# EAGLE design base_board7 (EAGLE 9.3.0)
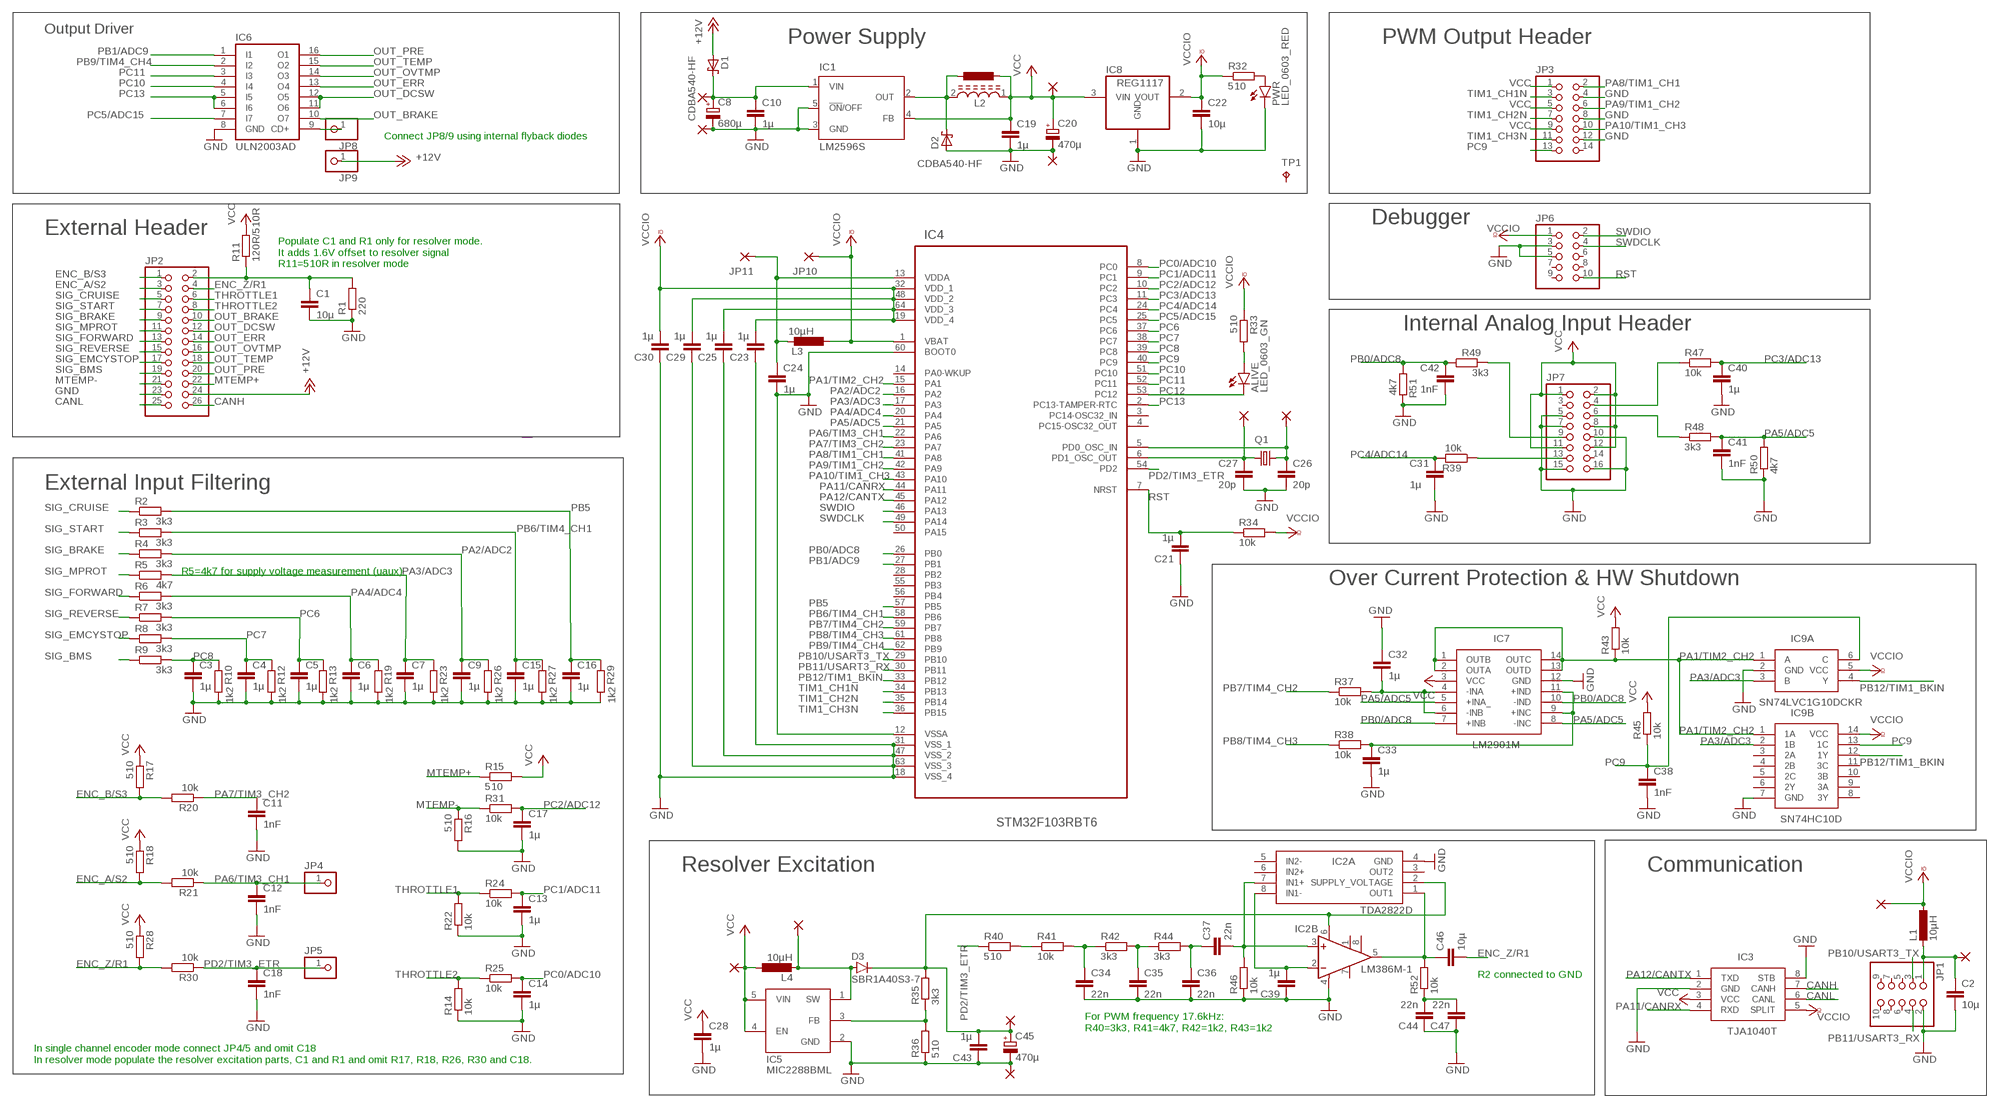
[diagram p0: schematic, sheet 1]

## Parts
ALIVE  LED_0603_GN  LEDSML0805  [SML0805]
C1  10µ  C-EUC0805K  [C0805K]
C2  10µ  C-EUC0805K  [C0805K]
C3  1µ  C-EUC0603K  [C0603K]
C4  1µ  C-EUC0603K  [C0603K]
C5  1µ  C-EUC0603K  [C0603K]
C6  1µ  C-EUC0603K  [C0603K]
C7  1µ  C-EUC0603K  [C0603K]
C8  680µ  CPOL-EU153CLV-1014  [153CLV-1014]
C9  1µ  C-EUC0603K  [C0603K]
C10  1µ  C-EUC0603K  [C0603K]
C11  1nF  C-EUC0603K  [C0603K]
C12  1nF  C-EUC0603K  [C0603K]
C13  1µ  C-EUC0603K  [C0603K]
C14  1µ  C-EUC0603K  [C0603K]
C15  1µ  C-EUC0603K  [C0603K]
C16  1µ  C-EUC0603K  [C0603K]
C17  1µ  C-EUC0603K  [C0603K]
C18  1nF  C-EUC0603K  [C0603K]
C19  1µ  C-EUC0603K  [C0603K]
C20  470µ  CPOL-EU153CLV-0605  [153CLV-0605]
C21  1µ  C-EUC0603K  [C0603K]
C22  10µ  C-EUC0805K  [C0805K]
C23  1µ  C-EUC0603K  [C0603K]
C24  1µ  C-EUC0603K  [C0603K]
C25  1µ  C-EUC0603K  [C0603K]
C26  20p  C-EUC0603K  [C0603K]
C27  20p  C-EUC0603K  [C0603K]
C28  1µ  C-EUC0603K  [C0603K]
C29  1µ  C-EUC0603K  [C0603K]
C30  1µ  C-EUC0603K  [C0603K]
C31  1µ  C-EUC0603K  [C0603K]
C32  1µ  C-EUC0603K  [C0603K]
C33  1µ  C-EUC0603K  [C0603K]
C34  22n  C-EUC0603K  [C0603K]
C35  22n  C-EUC0603K  [C0603K]
C36  22n  C-EUC0603K  [C0603K]
C37  22n  C-EUC0603K  [C0603K]
C38  1nF  C-EUC0603K  [C0603K]
C39  1µ  C-EUC0603K  [C0603K]
C40  1µ  C-EUC0603K  [C0603K]
C41  1nF  C-EUC0603K  [C0603K]
C42  1nF  C-EUC0603K  [C0603K]
C43  1µ  C-EUC0603K  [C0603K]
C44  22n  C-EUC0603K  [C0603K]
C45  470µ  CPOL-EU153CLV-0605  [153CLV-0605]
C46  10µ  C-EUC0805K  [C0805K]
C47  22n  C-EUC0603K  [C0603K]
D1  CDBA540-HF  SCHOTTKY-DIODESMD  [SMB]
D2  CDBA540-HF  SCHOTTKY-DIODESMD  [SMB]
D3  SBR1A40S3-7  D-SOD123  [SOD123]
IC1  LM2596S  [TO263-5]
IC2A  TDA2822D  [SOIC127P600X175-8N]
IC2B  LM386M-1  [SO08]
IC3  TJA1040T  [SOIC127P600X175-8N]
IC4  STM32F103RBT6  [QFP50P1200X1200X160-64N]
IC5  MIC2288BML  [SOT23-5L]
IC6  ULN2003AD  [SO16]
IC7  LM2901M  [SOP127P600X180-14N]
IC8  REG1117  [SOT223]
IC9A  SN74LVC1G10DCKR  [SOT65P210X110-6N]
IC9B  SN74HC10D  [SOIC127P600X175-14N]
JP1  PINHD-2X5/90  [2X05/90]
JP2  PINHD-2X13  [2X13]
JP3  PINHD-2X7  [2X07]
JP4  PINHD-1X1  [1X01]
JP5  PINHD-1X1  [1X01]
JP6  PINHD-2X5  [2X05]
JP7  PINHD-2X8  [2X08]
JP8  PINHD-1X1  [1X01]
JP9  PINHD-1X1  [1X01]
JP10  1,6/0,9  [1,6/0,9]
JP11  1,6/0,9  [1,6/0,9]
JP12  1,6/0,8  [1,6/0,8]
JP13  1,6/0,8  [1,6/0,8]
JP14  1,6/0,8  [1,6/0,8]
JP15  1,6/0,8  [1,6/0,8]
JP16  1,6/0,8  [1,6/0,8]
JP17  1,6/0,8  [1,6/0,8]
L1  10µH  L-EUL3225M  [L3225M]
L2  SRR1260-471K  [INDP125125X600N]
L3  10µH  L-EUL3225M  [L3225M]
L4  10µH  L-EUL3225M  [L3225M]
L5  L-EUTJ3-U1  [TJ3-U1]
PAD1  1,6/0,9  [1,6/0,9]
PAD2  1,6/0,9  [1,6/0,9]
PAD3  1,6/0,8  [1,6/0,8]
PAD4  1,6/0,8  [1,6/0,8]
PAD5  1,6/0,8  [1,6/0,8]
PAD6  1,6/0,8  [1,6/0,8]
PWR  LED_0603_RED  LEDSML0805  [SML0805]
Q1  CSM-7X-DU  [CSM-7X-DU]
R1  220  R-EU_R0603  [R0603]
R2  3k3  R-EU_R0603  [R0603]
R3  3k3  R-EU_R0603  [R0603]
R4  3k3  R-EU_R0603  [R0603]
R5  4k7  R-EU_R0603  [R0603]
R6  3k3  R-EU_R0603  [R0603]
R7  3k3  R-EU_R0603  [R0603]
R8  3k3  R-EU_R0603  [R0603]
R9  3k3  R-EU_R0603  [R0603]
R10  1k2  R-EU_R0603  [R0603]
R11  120R/510R  R-EU_R0603  [R0603]
R12  1k2  R-EU_R0603  [R0603]
R13  1k2  R-EU_R0603  [R0603]
R14  10k  R-EU_R0603  [R0603]
R15  510  R-EU_R0603  [R0603]
R16  510  R-EU_R0603  [R0603]
R17  510  R-EU_R0603  [R0603]
R18  510  R-EU_R0603  [R0603]
R19  1k2  R-EU_R0603  [R0603]
R20  10k  R-EU_R0603  [R0603]
R21  10k  R-EU_R0603  [R0603]
R22  10k  R-EU_R0603  [R0603]
R23  1k2  R-EU_R0603  [R0603]
R24  10k  R-EU_R0603  [R0603]
R25  10k  R-EU_R0603  [R0603]
R26  1k2  R-EU_R0603  [R0603]
R27  1k2  R-EU_R0603  [R0603]
R28  510  R-EU_R0603  [R0603]
R29  1k2  R-EU_R0603  [R0603]
R30  10k  R-EU_R0603  [R0603]
R31  10k  R-EU_R0603  [R0603]
R32  510  R-EU_R0603  [R0603]
R33  510  R-EU_R0603  [R0603]
R34  10k  R-EU_R0603  [R0603]
R35  3k3  R-EU_R0603  [R0603]
R36  510  R-EU_R0603  [R0603]
R37  10k  R-EU_R0603  [R0603]
R38  10k  R-EU_R0603  [R0603]
R39  10k  R-EU_R0603  [R0603]
R40  510  R-EU_R0603  [R0603]
R41  10k  R-EU_R0603  [R0603]
R42  3k3  R-EU_R0603  [R0603]
R43  10k  R-EU_R0603  [R0603]
R44  3k3  R-EU_R0603  [R0603]
R45  10k  R-EU_R0603  [R0603]
R46  10k  R-EU_R0603  [R0603]
R47  10k  R-EU_R0603  [R0603]
R48  3k3  R-EU_R0603  [R0603]
R49  3k3  R-EU_R0603  [R0603]
R50  4k7  R-EU_R0603  [R0603]
R51  4k7  R-EU_R0603  [R0603]
R52  10k  R-EU_R0603  [R0603]
TP1  TPB1,27  [B1,27]

## Nets
+12V: D1.A JP2.24 JP9.1
CANH: IC3.7(CANH) JP2.26
CANL: IC3.6(CANL) JP2.25
ENC_A/S2: JP2.3 R18.2 R21.2
ENC_B/S3: JP2.1 R17.2 R20.2
ENC_Z/R1: C46.2 JP2.4 R28.2 R30.2
GND: C1.2 C2.2 C3.2 C4.2 C5.2 C6.2 C7.2 C8.- C9.2 C10.2 C11.2 C12.2 C13.2 C14.2 C15.2 C16.2 C17.2 C18.2 C19.2 C20.- C21.1 C22.2 C23.1 C24.2 C25.1 C26.2 C27.2 C28.2 C29.1 C30.1 C31.2 C32.1 C33.2 C34.2 C35.2 C36.2 C38.2 C39.1 C40.2 C41.2 C42.2 C43.1 C44.1 C45.- C47.1 D2.A IC1.3(GND) IC1.5(!ON!/OFF) IC2A.4(GND) IC2B.4(GND) IC3.2(GND) IC3.8(STB) IC4.12(VSSA) IC4.18(VSS_4) IC4.31(VSS_1) IC4.47(VSS_2) IC4.60(BOOT0) IC4.63(VSS_3) IC5.2(GND) IC6.8(GND) IC7.12(GND) IC8.1(GND) IC9A.2(GND) IC9B.7(GND) JP1.2 JP2.23 JP3.4 JP3.8 JP3.12 JP6.3 JP6.5 JP7.5 JP7.7 JP7.10 JP7.15 JP7.16 PAD1.1(P) PAD3.1(P) PAD6.1(P) PWR.C R1.1 R10.2 R12.2 R13.2 R14.1 R16.2 R19.2 R22.1 R23.2 R26.2 R27.2 R29.2 R36.1 R46.1 R50.1 R51.2
MTEMP+: JP2.22 R15.1
MTEMP-: JP2.21 R16.1 R31.1
N$1: C1.1 JP2.2 R1.2 R11.1
N$2: ALIVE.A R33.2
N$3: D2.C IC1.2(OUT) L2.2 L5.1
N$4: C8.+ C10.1 D1.C IC1.1(VIN) PAD2.1(P)
N$5: PWR.A R32.2
N$7: C27.1 IC4.6(PD1_OSC_OUT) JP17.1(P) Q1.1
N$8: C24.1 IC4.13(VDDA) JP11.1(P) L3.1
N$9: IC6.9(CD+) JP8.1
N$10: JP7.9 R49.2
N$11: JP7.13 R39.1
N$12: JP7.4 R47.1
N$13: JP7.6 R48.1
N$14: C32.2 IC7.4(-INA) IC7.6(-INB) R37.2
N$15: C33.1 IC7.9(+INC) IC7.11(+IND) R38.2
N$16: D3.2(A) IC5.1(SW) JP13.1(P) L4.2
N$17: IC5.3(FB) R35.1 R36.2
N$18: C43.2 C45.+ D3.1(C) IC2A.2(SUPPLY_VOLTAGE) IC2B.6(VS) PAD5.1(P) R35.2
N$19: R40.2 R41.1
N$20: C34.1 R41.2 R42.1
N$21: C35.1 R42.2 R44.1
N$22: C36.1 C37.1 R44.2
N$23: C39.2 IC2A.8(IN1-) IC2B.2(-IN)
N$24: C37.2 IC2A.7(IN1+) IC2B.3(+IN) R46.2
N$25: C44.2 C47.2 R52.1
N$26: C46.1 IC2A.1(OUT1) IC2B.5(OUT) R52.2
N$27: C2.1 JP1.1 JP15.1(P) L1.2
N$28: C26.1 IC4.5(PD0_OSC_IN) JP16.1(P) Q1.2
OUT_BRAKE: IC6.10(O7) JP2.10
OUT_DCSW: IC6.11(O6) IC6.12(O5) JP2.12
OUT_ERR: IC6.13(O4) JP2.14
OUT_OVTMP: IC6.14(O3) JP2.16
OUT_PRE: IC6.16(O1) JP2.20
OUT_TEMP: IC6.15(O2) JP2.18
PA1/TIM2_CH2: IC4.15(PA1) IC7.1(OUTB) IC7.2(OUTA) IC7.13(OUTD) IC7.14(OUTC) IC9A.1(A) IC9B.1(1A) R43.1
PA2/ADC2: C9.1 IC4.16(PA2) R4.2 R26.1
PA3/ADC3: C7.1 IC4.17(PA3) IC9A.3(B) IC9B.2(1B) R5.2 R23.1
PA4/ADC4: C6.1 IC4.20(PA4) R6.2 R19.1
PA5/ADC5: C41.1 IC4.21(PA5) IC7.5(+INA_) IC7.8(-INC) R48.2 R50.2
PA6/TIM3_CH1: C12.1 IC4.22(PA6) JP4.1 R21.1
PA7/TIM3_CH2: C11.1 IC4.23(PA7) R20.1
PA8/TIM1_CH1: IC4.41(PA8) JP3.2
PA9/TIM1_CH2: IC4.42(PA9) JP3.6
PA10/TIM1_CH3: IC4.43(PA10) JP3.10
PA11/CANRX: IC3.4(RXD) IC4.44(PA11)
PA12/CANTX: IC3.1(TXD) IC4.45(PA12)
PB0/ADC8: C42.1 IC4.26(PB0) IC7.7(+INB) IC7.10(-IND) R49.1 R51.1
PB1/ADC9: IC4.27(PB1) IC6.1(I1)
PB5: C16.1 IC4.57(PB5) R2.2 R29.1
PB6/TIM4_CH1: C15.1 IC4.58(PB6) R3.2 R27.1
PB7/TIM4_CH2: IC4.59(PB7) R37.1
PB8/TIM4_CH3: IC4.61(PB8) R38.1
PB9/TIM4_CH4: IC4.62(PB9) IC6.2(I2)
PB10/USART3_TX: IC4.29(PB10) JP1.3
PB11/USART3_RX: IC4.30(PB11) JP1.4
PB12/TIM1_BKIN: IC4.33(PB12) IC9A.4(Y) IC9B.12(1Y)
PC0/ADC10: C14.1 IC4.8(PC0) R25.2
PC1/ADC11: C13.1 IC4.9(PC1) R24.2
PC2/ADC12: C17.1 IC4.10(PC2) R31.2
PC3/ADC13: C40.1 IC4.11(PC3) R47.2
PC4/ADC14: C31.1 IC4.24(PC4) R39.2
PC5/ADC15: IC4.25(PC5) IC6.7(I7)
PC6: C5.1 IC4.37(PC6) R7.2 R13.1
PC7: C4.1 IC4.38(PC7) R8.2 R12.1
PC8: C3.1 IC4.39(PC8) R9.2 R10.1
PC9: C38.1 IC4.40(PC9) IC9A.6(C) IC9B.13(1C) JP3.13 R45.1
PC10: IC4.51(PC10) IC6.4(I4)
PC11: IC4.52(PC11) IC6.3(I3)
PC12: ALIVE.C IC4.53(PC12)
PC13: IC4.2(PC13-TAMPER-RTC) IC6.5(I5) IC6.6(I6)
PD2/TIM3_ETR: C18.1 IC4.54(PD2) JP5.1 R30.1 R40.1
RST: C21.2 IC4.7(NRST) JP6.10 R34.1
SIG_BMS: JP2.19 R9.1
SIG_BRAKE: JP2.9 R4.1
SIG_CRUISE: JP2.5 R2.1
SIG_EMCYSTOP: JP2.17 R8.1
SIG_FORWARD: JP2.13 R6.1
SIG_MPROT: JP2.11 R5.1
SIG_REVERSE: JP2.15 R7.1
SIG_START: JP2.7 R3.1
SWDCLK: IC4.49(PA14) JP6.4
SWDIO: IC4.46(PA13) JP6.2
THROTTLE1: JP2.6 R22.2 R24.1
THROTTLE2: JP2.8 R14.2 R25.1
TIM1_CH1N: IC4.34(PB13) JP3.3
TIM1_CH2N: IC4.35(PB14) JP3.7
TIM1_CH3N: IC4.36(PB15) JP3.11
VCC: C19.1 C20.+ C28.1 IC1.4(FB) IC3.3(VCC) IC5.4(EN) IC5.5(VIN) IC7.3(VCC) IC8.3(VIN) JP3.1 JP3.5 JP3.9 JP7.1 JP7.2 JP7.8 JP7.11 JP7.12 JP12.1(P) L2.1 L4.1 L5.2 PAD4.1(P) R11.2 R15.2 R17.1 R18.1 R28.1 R43.2 R45.2
VCCIO: C22.1 C23.2 C25.2 C29.2 C30.2 IC3.5(SPLIT) IC4.1(VBAT) IC4.19(VDD_4) IC4.32(VDD_1) IC4.48(VDD_2) IC4.64(VDD_3) IC8.2(VOUT) IC9A.5(VCC) IC9B.14(VCC) JP6.1 JP10.1(P) JP14.1(P) L1.1 L3.2 R32.1 R33.1 R34.2
Unconnected: IC2A.3(OUT2) IC2A.5(IN2-) IC2A.6(IN2+) IC2B.1(GAIN) IC2B.7(BYPASS) IC2B.8(GAIN) IC4.3(PC14-OSC32_IN) IC4.4(PC15-OSC32_OUT) IC4.14(PA0-WKUP) IC4.28(PB2) IC4.50(PA15) IC4.55(PB3) IC4.56(PB4) IC9B.3(2A) IC9B.4(2B) IC9B.5(2C) IC9B.6(2Y) IC9B.8(3Y) IC9B.9(3A) IC9B.10(3B) IC9B.11(3C) JP1.5 JP1.6 JP1.7 JP1.8 JP1.9 JP1.10 JP3.14 JP6.6 JP6.7 JP6.8 JP6.9 JP7.3 JP7.14 TP1.TP

## Notes on the sheet
- Output Driver
- Power Supply | PWM Output Header
- Connect JP8/9 using internal flyback diodes
- Debugger
- External Header
- Populate C1 and R1 only for resolver mode.
  It adds 1.6V offset to resolver signal
  R11=510R in resolver mode
- Internal Analog Input Header
- External Input Filtering
- R5=4k7 for supply voltage measurement (uaux)
- Over Current Protection & HW Shutdown
- Resolver Excitation | Communication
- R2 connected to GND
- For PWM frequency 17.6kHz:
  R40=3k3, R41=4k7, R42=1k2, R43=1k2
- In single channel encoder mode connect JP4/5 and omit C18
  In resolver mode populate the resolver excitation parts, C1 and R1 and omit R17, R18, R26, R30 and C18.

## Library data of the parts
ALIVE PWR = led:LED: LED OSRAM: - CHIPLED LG R971, LG N971, LY N971, LG Q971, LY Q971, LO R971, LY R971 LH N974, LH R974 LS Q976, LO Q976, LY Q976 LO Q996 - Hyper CHIPLED LW Q18S LB Q993, LB Q99A, LB R99A - SideLED LS A670, LO A670, LY A670, LG A670, LP A670 LB A673, LV A673, LT A673, LW A673 LH A674 LY A675 LS A676, LA A676, LO A676, LY A676, LW A676 LS A679, LY A679, LG A679 - Hyper Micro SIDELED® LS Y876, LA Y876, LO Y876, LY Y876 LT Y87S - SmartLED LW L88C, LW L88S LB L89C, LB L89S, LG L890 LS L89K, LO L89K, LY L89K LS L896, LA L896, LO L896, LY L896 - TOPLED LS T670, LO T670, LY T670, LG T670, LP T670 LSG T670, LSP T670, LSY T670, LOP T670, LYG T670 LG T671, LOG T671, LSG T671 LB T673, LV T673, LT T673, LW T673 LH T674 LS T676, LA T676, LO T676, LY T676, LB T676, LH T676, LSB T676, LW T676 LB T67C, LV T67C, LT T67C, LS T67K, LO T67K, LY T67K, LW E67C LS E67B, LA E67B, LO E67B, LY E67B, LB E67C, LV E67C, LT E67C LW T67C LS T679, LY T679, LG T679 LS T770, LO T770, LY T770, LG T770, LP T770 LB T773, LV T773, LT T773, LW T773 LH T774 LS E675, LA E675, LY E675, LS T675 LS T776, LA T776, LO T776, LY T776, LB T776 LHGB T686 LT T68C, LB T68C - Hyper Mini TOPLED® LB M676 - Mini TOPLED Santana® LG M470 LS M47K, LO M47K, LY M47K Source: http://www.osram.convergy.de LUXEON: - LUMILED® LXK2-PW12-R00, LXK2-PW12-S00, LXK2-PW14-U00, LXK2-PW14-V00 LXK2-PM12-R00, LXK2-PM12-S00, LXK2-PM14-U00 LXK2-PE12-Q00, LXK2-PE12-R00, LXK2-PE12-S00, LXK2-PE14-T00, LXK2-PE14-U00 LXK2-PB12-K00, LXK2-PB12-L00, LXK2-PB12-M00, LXK2-PB14-N00, LXK2-PB14-P00, LXK2-PB14-Q00 LXK2-PR12-L00, LXK2-PR12-M00, LXK2-PR14-Q00, LXK2-PR14-R00 LXK2-PD12-Q00, LXK2-PD12-R00, LXK2-PD12-S00 LXK2-PH12-R00, LXK2-PH12-S00 LXK2-PL12-P00, LXK2-PL12-Q00, LXK2-PL12-R00 Source: www.luxeon.com KINGBRIGHT: KA-3528ASYC Source: www.kingbright.com
C1-C7 C9-C19 C21-C44 C46 C47 = resistor:C-EU: CAPACITOR, European symbol
C8 C20 C45 = resistor:CPOL-EU: POLARIZED CAPACITOR, European symbol
D1 D2 = diode:SCHOTTKY-DIODE: Schottky Diode
D3 = semicon-smd-ipc:D-: DIODE unfilled
IC1 = national-semiconductor:LM2596: SIMPLE SWITCHER® Power Converter 150 kHz 3A Step-Down Voltage Regulator Source: http://www.national.com/ds/LM/LM2596.pdf; MF: NATIONAL SEMICONDUCTOR; MPN: LM2596S-ADJ/NOPB; OC_FARNELL: 9494367; OC_NEWARK: 41K3842
IC2A = SamacSys_Parts:TDA2822D: Quadmm TDA2822D, Audio Amplifier Class-AB mono/stereo +150C 8-Pin SOIC Source: Datasheet <http://docs-emea.rs-online.com/webdocs/0acf/0900766b80acf19c.pdf>; ALLIED_NUMBER: 70391772; ALLIED_PRICE-STOCK: http://www.alliedelec.com/stmicroelectronics-tda2822d/70391772/; DESCRIPTION: Quadmm TDA2822D, Audio Amplifier Class-AB mono/stereo +150C 8-Pin SOIC; HEIGHT: 1.75mm; MANUFACTURER_NAME: STMicroelectronics; MANUFACTURER_PART_NUMBER: TDA2822D; MOUSER_PART_NUMBER: 511-TDA2822D; MOUSER_PRICE-STOCK: https://www.mouser.com/Search/Refine.aspx?Keyword=511-TDA2822D; RS_PART_NUMBER: 0426162P; RS_PRICE-STOCK: http://uk.rs-online.com/web/p/products/0426162P
IC2B = linear:LM386?-*: Low Voltage Audio Power Amplifier Source: http://cache.national.com/ds/LM/LM386.pdf
IC3 = SamacSys_Parts:TJA1040T: NXP TJA1040T, CAN Transceiver 1MBd 1-channel ISO 11898, 8-Pin SOIC Source: Datasheet <https://docs-emea.rs-online.com/webdocs/0425/0900766b804252fe.pdf>; DESCRIPTION: NXP TJA1040T, CAN Transceiver 1MBd 1-channel ISO 11898, 8-Pin SOIC; HEIGHT: 1.75mm; MANUFACTURER_NAME: NXP; MANUFACTURER_PART_NUMBER: TJA1040T; MOUSER_PART_NUMBER: 4837547; MOUSER_PRICE-STOCK: http://uk.rs-online.com/web/p/products/4837547; RS_PART_NUMBER: 4837547; RS_PRICE-STOCK: http://uk.rs-online.com/web/p/products/4837547
IC4 = STM32F103RBT6:STM32F103RBT6: 32BIT MCU; DESCRIPTION: Mainstream Performance line, ARM Cortex-M3 MCU with 128 Kbytes Flash, 72 MHz CPU, motor control, USB and CAN; DIGI-KEY_PART_NUMBER: 497-6066-ND; DIGI-KEY_PURCHASE_URL: https://www.digikey.ca/product-detail/en/stmicroelectronics/STM32F103RBT6/497-6066-ND/1646341?utm_source=snapeda&utm_medium=aggregator&utm_campaign=symbol; MF: STMicroelectronics; MP: STM32F103RBT6; PACKAGE: LQFP-64 STMicroelectronics
IC5 = MIC2288:MIC2288BML: Boost 3V-4.2V input to adjustable output (Micrel)
IC6 = uln-udn:ULN2003A: DRIVER ARRAY
IC7 = SamacSys_Parts:LM2901M: IC COMPARATOR QUAD VOLT Source: Datasheet <http://www.ti.com/lit/ds/symlink/lm2901-n.pdf>; DESCRIPTION: IC COMPARATOR QUAD VOLT; HEIGHT: mm; MANUFACTURER_NAME: National Semiconductor; MANUFACTURER_PART_NUMBER: LM2901M; MOUSER_PART_NUMBER: 4716204; MOUSER_PRICE-STOCK: http://uk.rs-online.com/web/p/products/4716204; RS_PART_NUMBER: 4716204; RS_PRICE-STOCK: http://uk.rs-online.com/web/p/products/4716204
IC8 = burr-brown:REG1117: 800mA and 1A Low Dropout (LDO) Positive Regulator 1.8V, 2.5V, 2.85V, 3.3V, 5V, and Adj; MPN: REG1117; OC_FARNELL: 1097566; OC_NEWARK: 14P6981
IC9A = SamacSys_Parts:SN74LVC1G10DCKR: Texas Instruments SN74LVC1G10DCKR, NAND 3 Input NAND, 1.65 5.5 V, 6-Pin SC-70 Source: Datasheet <http://www.ti.com/general/docs/lit/getliterature.tsp?genericPartNumber=SN74LVC1G10&&fileType=pdf>; DESCRIPTION: Texas Instruments SN74LVC1G10DCKR, NAND 3 Input NAND, 1.65 5.5 V, 6-Pin SC-70; HEIGHT: 1.1mm; MANUFACTURER_NAME: Texas Instruments; MANUFACTURER_PART_NUMBER: SN74LVC1G10DCKR; MOUSER_PART_NUMBER: 595-SN74LVC1G10DCKR; MOUSER_PRICE-STOCK: https://www.mouser.com/Search/Refine.aspx?Keyword=595-SN74LVC1G10DCKR; RS_PART_NUMBER: 1627462; RS_PRICE-STOCK: http://uk.rs-online.com/web/p/products/1627462
IC9B = SamacSys_Parts:SN74HC10D: Triple 3-Input Positive-NAND Gates Source: Datasheet <http://www.ti.com/lit/ds/symlink/sn74hc10.pdf>; DESCRIPTION: Triple 3-Input Positive-NAND Gates; HEIGHT: 1.75mm; MANUFACTURER_NAME: Texas Instruments; MANUFACTURER_PART_NUMBER: SN74HC10D; MOUSER_PART_NUMBER: 595-SN74HC10D; MOUSER_PRICE-STOCK: https://www.mouser.com/Search/Refine.aspx?Keyword=595-SN74HC10D; RS_PART_NUMBER: 6631896P; RS_PRICE-STOCK: http://uk.rs-online.com/web/p/products/6631896P
JP1 JP6 = pinhead:PINHD-2X5: PIN HEADER
JP2 = pinhead:PINHD-2X13: PIN HEADER
JP3 = pinhead:PINHD-2X7: PIN HEADER
JP4 JP5 JP8 JP9 = pinhead:PINHD-1X1: PIN HEADER
JP7 = pinhead:PINHD-2X8: PIN HEADER
JP10 JP11 PAD1 PAD2 = wirepad:1,6/0,9: THROUGH-HOLE PAD
JP12-JP17 PAD3-PAD6 = wirepad:1,6/0,8: THROUGH-HOLE PAD
L1 L3 L4 = rcl:L-EU: INDUCTOR, European symbol; SPICEPREFIX: L
L2 = SRR1260-471K:SRR1260-471K: Inductor Power Shielded Wirewound 33uH 20% 100KHz 27Q-Factor Ferrite 3A 60mOhm DCR T/R; AVAILABILITY: Unavailable; DESCRIPTION: Inductor Power Shielded Wirewound 470uH 10% 100KHz 18Q-Factor Ferrite 950mA 820mOhm DCR T/R; MF: Bourns; MP: SRR1260-471K; PACKAGE: Nonstandard Bourns; PRICE: None
L5 = resistor:L-EU: INDUCTOR, European symbol
Q1 = crystal:CSM-7X-DU: SMD CRYSTAL Source: www.ecsxtal.com .. Crystal 3.6864MHz CSM_7X_DU.PDF; OC_FARNELL: unknown; OC_NEWARK: unknown
R1-R52 = rcl:R-EU_: RESISTOR, European symbol; SPICEPREFIX: R
TP1 = testpad:TP: Test pad

## Board
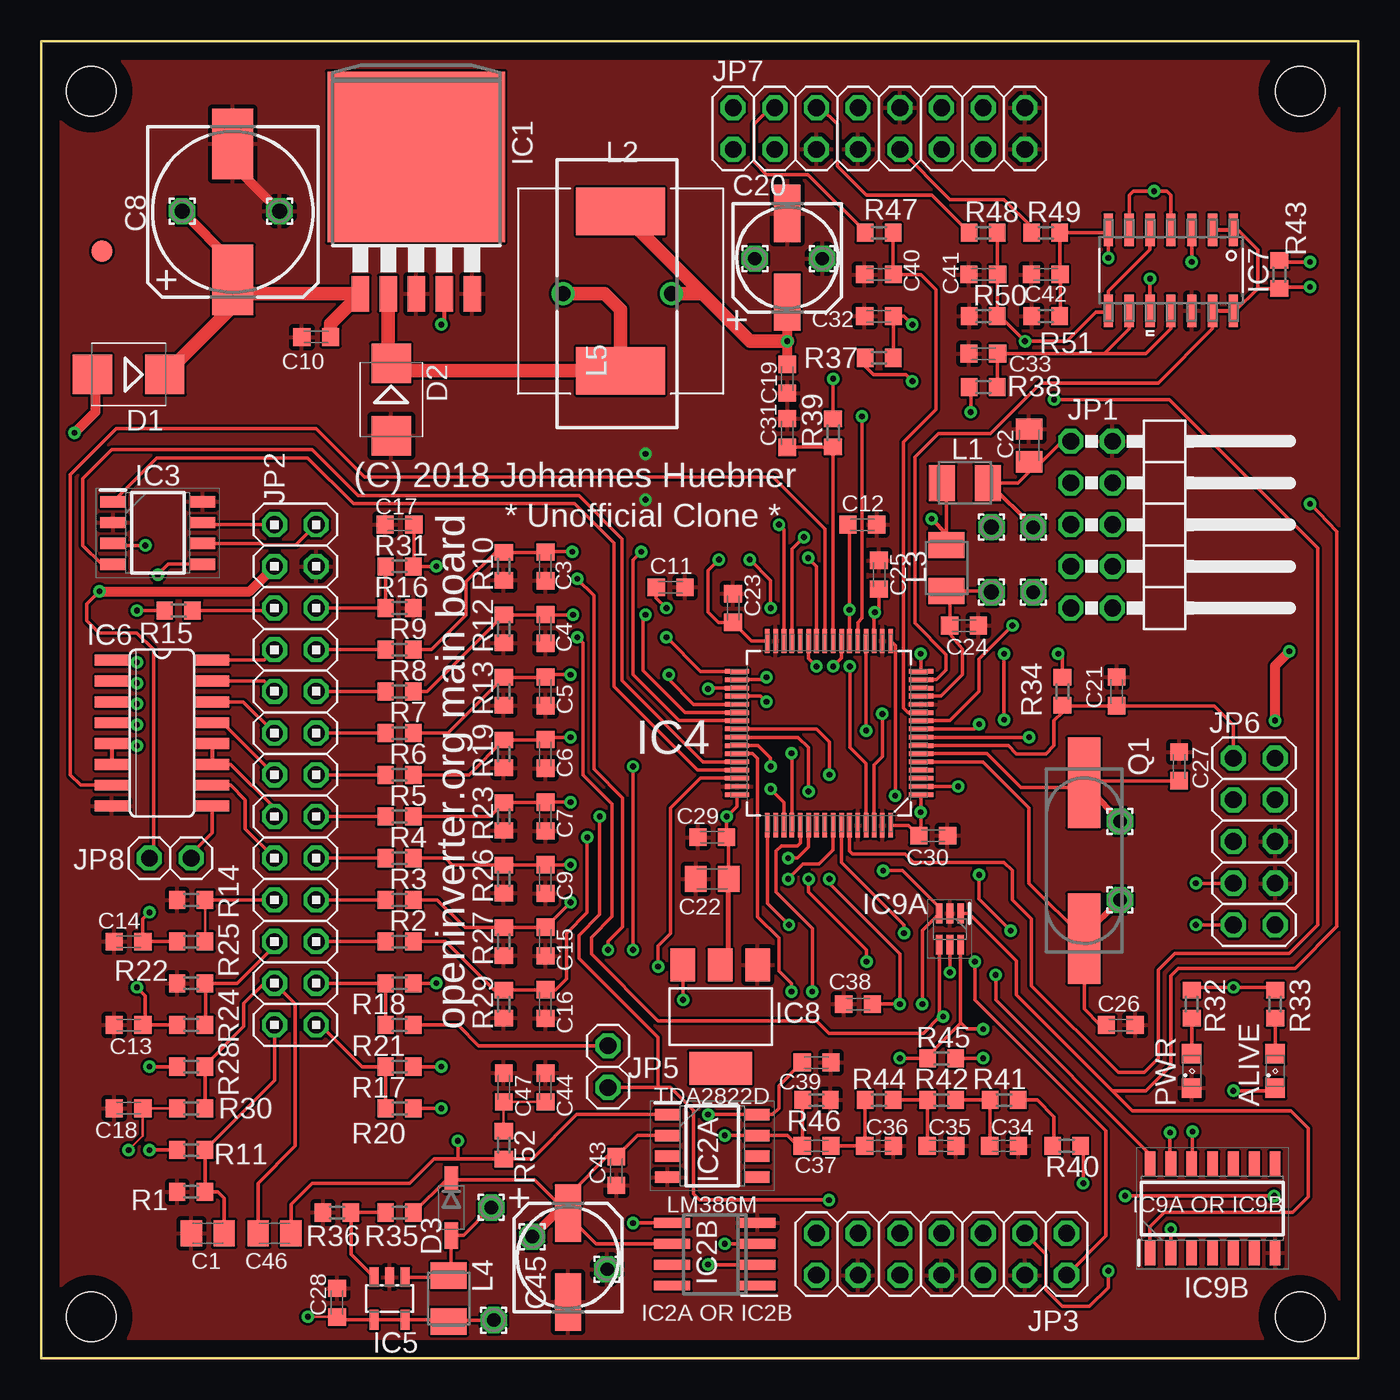
[diagram p1: board, top side]
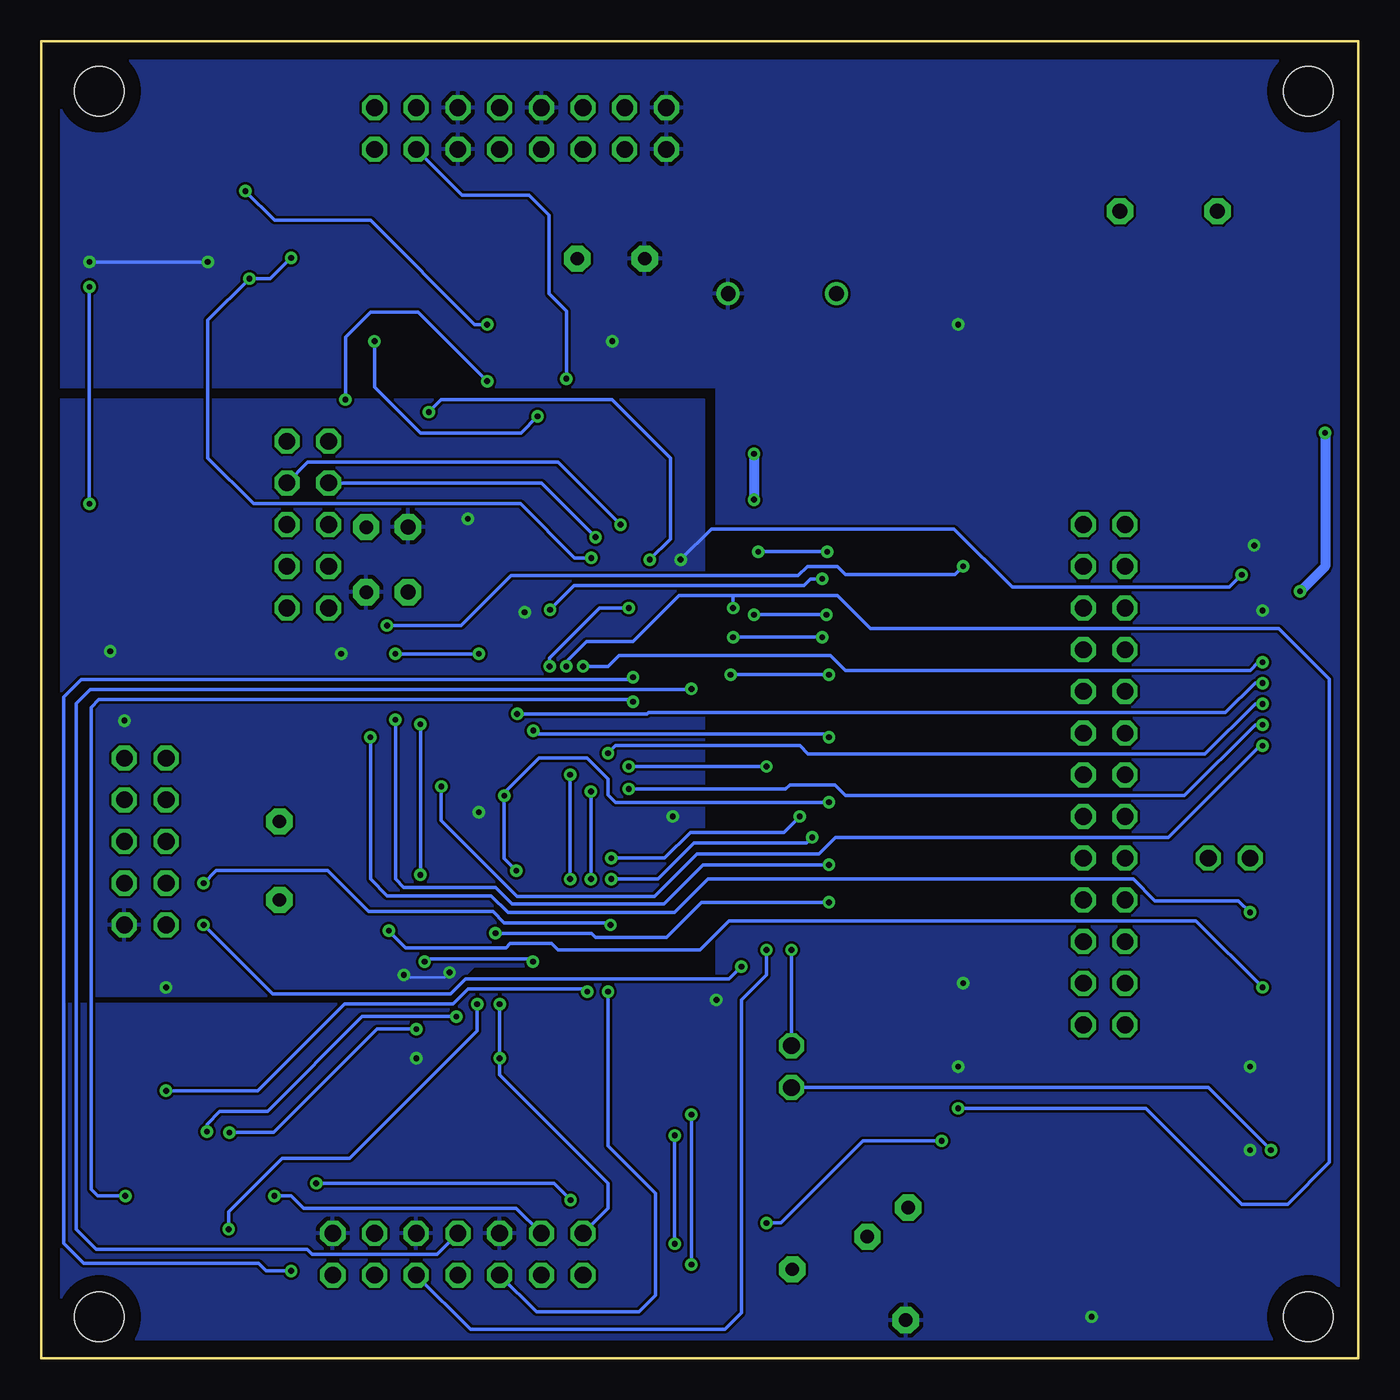
[diagram p2: board, bottom side, seen from below]

Size 80.26 x 80.26 mm. Coordinates in mm from the lower left corner, seen from the top.
Outline: 0,80.26 80.26,80.26 80.26,0 0,0 0,80.26
Copper layers (1*16): Top 0.035mm / dielectric 1.5mm / Bottom 0.035mm
Design rules "default": minimum track width 6mil, minimum drill 0.35mm, track to track 6mil, track to pad 6mil, pad to pad 6mil, via to via 6mil, smd to smd 6mil, copper to edge 40mil, drill to drill 6mil, minimum pad ring 10mil, minimum via ring 8mil, stop-mask expansion 4mil, vias tented up to drill 0mil, thermal gap 10mil
Holes 3 mm at 3.05,77.22 3.05,2.54 76.71,77.22 76.71,2.54

### Footprints (pad centres in the part's own frame; a part is rotated, then mirrored left to right if it is on the bottom)
SML0805 = smd 1.2 x 1.2: A 1.05,0; C -1.05,0
C0805K = smd 1.3 x 1.6: 1 -1,0; 2 1,0
C0603K = smd 1.05 x 1.08: 1 -0.875,0; 2 0.875,0
153CLV-1014 = smd 4.3 x 2.5: + 4.15,0; - -4.15,0
153CLV-0605 = smd 3.5 x 1.6: + 2.7,0; - -2.7,0
SMB = smd 2.4 x 2.4: A 2.2,0; C -2.2,0
SOD123 = smd 1.6 x 0.8: 1 -1.7,0; 2 1.7,0
TO263-5 = smd 1.067 x 2.159: 1 -3.404,-5.791; 2 -1.702,-5.791; 3 0,-5.791; 4 1.702,-5.791; 5 3.404,-5.791 | smd 10.8 x 10.41: 6 0,2.54
SOIC127P600X175-8N = smd 1.55 x 0.7: 1 -2.725,1.905; 2 -2.725,0.635; 3 -2.725,-0.635; 4 -2.725,-1.905; 5 2.725,-1.905; 6 2.725,-0.635; 7 2.725,0.635; 8 2.725,1.905
SO08 = smd 0.6 x 2.2: 1 -1.905,-2.6; 2 -0.635,-2.6; 3 0.635,-2.6; 4 1.905,-2.6; 5 1.905,2.6; 6 0.635,2.6; 7 -0.635,2.6; 8 -1.905,2.6
QFP50P1200X1200X160-64N = smd 1.473 x 0.279: 1 -5.613,3.759; 2 -5.613,3.251; 3 -5.613,2.743; 4 -5.613,2.261; 5 -5.613,1.753; 6 -5.613,1.245; 7 -5.613,0.762; 8 -5.613,0.254; 9 -5.613,-0.254; 10 -5.613,-0.762; 11 -5.613,-1.245; 12 -5.613,-1.753; 13 -5.613,-2.261; 14 -5.613,-2.743; 15 -5.613,-3.251; 16 -5.613,-3.759; 33 5.613,-3.759; 34 5.613,-3.251; 35 5.613,-2.743; 36 5.613,-2.261; 37 5.613,-1.753; 38 5.613,-1.245; 39 5.613,-0.762; 40 5.613,-0.254; 41 5.613,0.254; 42 5.613,0.762; 43 5.613,1.245; 44 5.613,1.753; 45 5.613,2.261; 46 5.613,2.743; 47 5.613,3.251; 48 5.613,3.759 | smd 0.279 x 1.473: 17 -3.759,-5.613; 18 -3.251,-5.613; 19 -2.743,-5.613; 20 -2.261,-5.613; 21 -1.753,-5.613; 22 -1.245,-5.613; 23 -0.762,-5.613; 24 -0.254,-5.613; 25 0.254,-5.613; 26 0.762,-5.613; 27 1.245,-5.613; 28 1.753,-5.613; 29 2.261,-5.613; 30 2.743,-5.613; 31 3.251,-5.613; 32 3.759,-5.613; 49 3.759,5.613; 50 3.251,5.613; 51 2.743,5.613; 52 2.261,5.613; 53 1.753,5.613; 54 1.245,5.613; 55 0.762,5.613; 56 0.254,5.613; 57 -0.254,5.613; 58 -0.762,5.613; 59 -1.245,5.613; 60 -1.753,5.613; 61 -2.261,5.613; 62 -2.743,5.613; 63 -3.251,5.613; 64 -3.759,5.613
SOT23-5L = smd 0.55 x 1.2: 1 -0.95,-1.3; 2 0,-1.3; 3 0.95,-1.3; 4 0.95,1.3; 5 -0.95,1.3
SO16 = smd 0.66 x 2.032: 1 -4.445,-3.073; 2 -3.175,-3.073; 3 -1.905,-3.073; 4 -0.635,-3.073; 5 0.635,-3.073; 6 1.905,-3.073; 7 3.175,-3.073; 8 4.445,-3.073; 9 4.445,3.073; 10 3.175,3.073; 11 1.905,3.073; 12 0.635,3.073; 13 -0.635,3.073; 14 -1.905,3.073; 15 -3.175,3.073; 16 -4.445,3.073
SOP127P600X180-14N = smd 1.981 x 0.559: 1 -2.464,3.81; 2 -2.464,2.54; 3 -2.464,1.27; 4 -2.464,0; 5 -2.464,-1.27; 6 -2.464,-2.54; 7 -2.464,-3.81; 8 2.464,-3.81; 9 2.464,-2.54; 10 2.464,-1.27; 11 2.464,0; 12 2.464,1.27; 13 2.464,2.54; 14 2.464,3.81
SOT223 = smd 1.499 x 2.007: 1 -2.261,-3.15; 2 0.025,-3.15; 3 2.311,-3.15 | smd 3.81 x 2.007: 4 0,3.15
SOT65P210X110-6N = smd 1.2 x 0.4: 1 -0.95,0.65; 2 -0.95,0; 3 -0.95,-0.65; 4 0.95,-0.65; 5 0.95,0; 6 0.95,0.65
SOIC127P600X175-14N = smd 1.525 x 0.65: 1 -2.712,3.81; 2 -2.712,2.54; 3 -2.712,1.27; 4 -2.712,0; 5 -2.712,-1.27; 6 -2.712,-2.54; 7 -2.712,-3.81; 8 2.712,-3.81; 9 2.712,-2.54; 10 2.712,-1.27; 11 2.712,0; 12 2.712,1.27; 13 2.712,2.54; 14 2.712,3.81
2X05/90 = drill 1.016 octagon: 1 -5.08,-6.35; 2 -5.08,-3.81; 3 -2.54,-6.35; 4 -2.54,-3.81; 5 0,-6.35; 6 0,-3.81; 7 2.54,-6.35; 8 2.54,-3.81; 9 5.08,-6.35; 10 5.08,-3.81
2X13 = drill 1.016 octagon: 1 -15.24,-1.27; 2 -15.24,1.27; 3 -12.7,-1.27; 4 -12.7,1.27; 5 -10.16,-1.27; 6 -10.16,1.27; 7 -7.62,-1.27; 8 -7.62,1.27; 9 -5.08,-1.27; 10 -5.08,1.27; 11 -2.54,-1.27; 12 -2.54,1.27; 13 0,-1.27; 14 0,1.27; 15 2.54,-1.27; 16 2.54,1.27; 17 5.08,-1.27; 18 5.08,1.27; 19 7.62,-1.27; 20 7.62,1.27; 21 10.16,-1.27; 22 10.16,1.27; 23 12.7,-1.27; 24 12.7,1.27; 25 15.24,-1.27; 26 15.24,1.27
2X07 = drill 1.016 octagon: 1 -7.62,-1.27; 2 -7.62,1.27; 3 -5.08,-1.27; 4 -5.08,1.27; 5 -2.54,-1.27; 6 -2.54,1.27; 7 0,-1.27; 8 0,1.27; 9 2.54,-1.27; 10 2.54,1.27; 11 5.08,-1.27; 12 5.08,1.27; 13 7.62,-1.27; 14 7.62,1.27
1X01 = drill 1.016 octagon: 1 0,0
2X05 = drill 1.016 octagon: 1 -5.08,-1.27; 2 -5.08,1.27; 3 -2.54,-1.27; 4 -2.54,1.27; 5 0,-1.27; 6 0,1.27; 7 2.54,-1.27; 8 2.54,1.27; 9 5.08,-1.27; 10 5.08,1.27
2X08 = drill 1.016 octagon: 1 -8.89,-1.27; 2 -8.89,1.27; 3 -6.35,-1.27; 4 -6.35,1.27; 5 -3.81,-1.27; 6 -3.81,1.27; 7 -1.27,-1.27; 8 -1.27,1.27; 9 1.27,-1.27; 10 1.27,1.27; 11 3.81,-1.27; 12 3.81,1.27; 13 6.35,-1.27; 14 6.35,1.27; 15 8.89,-1.27; 16 8.89,1.27
1,6/0,9 = drill 0.914 pad 1.6 octagon: 1 0,0
1,6/0,8 = drill 0.813 pad 1.6 octagon: 1 0,0
L3225M = smd 1.6 x 2.2: 1 -1.4,0; 2 1.4,0
INDP125125X600N = smd 2.9 x 5.4: 1 -4.85,0; 2 4.85,0
TJ3-U1 = drill 0.9: 1 -3.3,0; 2 3.3,0
CSM-7X-DU = smd 5.5 x 2: 1 -4.75,0; 2 4.75,0
R0603 = smd 1 x 1.1: 1 -0.85,0; 2 0.85,0
B1,27 = smd 1.27 x 1.27: TP 0,0

### Placement (x,y rotation side)
ALIVE  75.18,17.53 90 top
C1  10.16,7.62 180 top
C2  60.2,55.63 90 top
C3  30.73,48.26 270 top
C4  30.73,44.45 270 top
C5  30.73,40.64 270 top
C6  30.73,36.83 270 top
C7  30.73,33.02 270 top
C8  11.68,69.85 270 top
C9  30.73,29.21 270 top
C10  16.76,62.23 180 top
C11  38.35,46.99 0 top
C12  50.04,50.8 0 top
C13  5.33,20.32 180 top
C14  5.33,25.4 180 top
C15  30.73,25.4 270 top
C16  30.73,21.59 270 top
C17  21.84,50.8 180 top
C18  5.33,15.24 180 top
C19  45.47,59.69 270 top
C20  45.47,67.06 270 top
C21  65.53,40.64 270 top
C22  40.89,29.21 180 top
C23  42.16,45.72 270 top
C24  56.24,44.65 0 top
C25  51.05,47.75 270 top
C26  65.79,20.32 0 top
C27  69.34,36.07 90 top
C28  18.03,3.4 90 top
C29  40.89,31.75 0 top
C30  54.36,31.85 180 top
C31  45.47,56.39 90 top
C32  51.05,63.5 0 top
C33  57.4,61.21 180 top
C34  58.67,12.95 0 top
C35  54.86,12.95 0 top
C36  51.05,12.95 0 top
C37  47.24,12.95 180 top
C38  49.78,21.59 180 top
C39  47.24,18.03 180 top
C40  51.05,66.04 180 top
C41  57.4,66.04 180 top
C42  61.21,66.04 180 top
C43  35.05,11.43 90 top
C44  30.73,16.51 270 top
C45  32.11,6.15 90 top
C46  14.22,7.62 180 top
C47  28.19,16.51 270 top
D1  5.33,59.94 180 top
D2  21.34,58.42 270 top
D3  24.99,9.19 270 top
IC1  22.86,70.66 0 top
IC2A  40.89,12.95 0 top
IC2B  41.05,6.35 90 top
IC3  7.11,50.29 0 top
IC4  48.01,38.1 180 top
IC5  21.23,3.66 180 top
IC6  7.37,38.1 270 top
IC7  68.83,66.29 270 top
IC8  41.4,20.83 180 top
IC9A  55.37,26.16 270 top
IC9B  71.37,9.14 90 top
JP1  69.09,50.8 270 top
JP2  15.49,35.56 90 top
JP3  54.86,6.35 180 top
JP4  34.54,19.05 0 top
JP5  34.54,16.51 0 top
JP6  73.91,31.5 90 top
JP7  51.05,74.93 0 top
JP8  9.14,30.48 0 top
JP9  6.6,30.48 0 top
JP10  57.91,50.65 0 top
JP11  57.91,46.69 0 top
JP12  27.58,2.34 0 top
JP13  27.43,9.19 0 top
JP14  60.45,46.69 0 top
JP15  60.45,50.65 0 top
JP16  65.74,27.94 0 top
JP17  65.74,32.72 0 top
L1  56.29,53.34 0 top
L2  35.31,65.02 270 top
L3  55.17,48.16 90 top
L4  24.84,3.66 90 top
L5  35.1,64.87 0 top
PAD1  14.53,69.9 0 top
PAD2  8.59,69.9 0 top
PAD3  47.6,67.01 0 top
PAD4  43.48,67.01 0 top
PAD5  29.92,7.42 0 top
PAD6  34.49,5.44 0 top
PWR  70.1,17.53 90 top
Q1  63.55,30.33 270 top
R1  9.14,10.16 0 top
R2  21.84,25.4 0 top
R3  21.84,27.94 0 top
R4  21.84,30.48 0 top
R5  21.84,33.02 0 top
R6  21.84,35.56 0 top
R7  21.84,38.1 0 top
R8  21.84,40.64 0 top
R9  21.84,43.18 0 top
R10  28.19,48.26 270 top
R11  9.14,12.7 180 top
R12  28.19,44.45 270 top
R13  28.19,40.64 270 top
R14  9.14,27.94 0 top
R15  8.38,45.57 180 top
R16  21.84,45.72 0 top
R17  21.84,17.78 180 top
R18  21.84,22.86 180 top
R19  28.19,36.83 270 top
R20  21.84,15.24 180 top
R21  21.84,20.32 180 top
R22  9.14,22.86 0 top
R23  28.19,33.02 270 top
R24  9.14,20.32 180 top
R25  9.14,25.4 180 top
R26  28.19,29.21 270 top
R27  28.19,25.4 270 top
R28  9.14,17.78 0 top
R29  28.19,21.59 270 top
R30  9.14,15.24 0 top
R31  21.84,48.26 0 top
R32  70.1,21.59 270 top
R33  75.18,21.59 270 top
R34  62.23,40.64 90 top
R35  21.84,8.89 0 top
R36  18.03,8.89 0 top
R37  51.05,60.96 0 top
R38  57.4,59.18 0 top
R39  48.26,56.39 270 top
R40  62.48,12.95 180 top
R41  58.67,15.75 180 top
R42  54.86,15.75 180 top
R43  75.44,66.04 90 top
R44  51.05,15.75 180 top
R45  54.86,18.29 0 top
R46  47.24,15.75 180 top
R47  51.05,68.58 0 top
R48  57.4,68.58 0 top
R49  61.21,68.58 180 top
R50  57.4,63.5 0 top
R51  61.21,63.5 180 top
R52  28.19,13 270 top
TP1  3.71,67.46 0 top

### Tracks (layer width: path | path; a pad name or v marks a point on that pad's centre or on a via)
+12V  (via drill 0.35)
  Top 0.152: D1.A 3.3,59.78
  Top 0.203: JP9.1 6.86,30.73 6.86,43.18 5.84,44.2 3.56,44.2 2.79,44.96 2.79,45.97 v3.56,46.74
  Top 0.61: v2.03,56.39 3.3,57.66 3.3,59.78 | v3.56,46.74 12.7,46.74 JP2.24
  Bottom 0.61: v2.03,56.39 2.03,48.26 v3.56,46.74
CANH
  Top 0.152: 9.96,50.8 IC3.7
  Top 0.203: JP2.26 9.96,50.8
CANL
  Top 0.203: IC3.6 13.44,49.66 13.55,49.56 15.52,49.56 JP2.25
ENC_A/S2
  Top 0.203: JP2.3 R18.2 R21.2
ENC_B/S3
  Top 0.203: R20.2 R17.2 19.56,17.78 17.02,20.32 JP2.1
ENC_Z/R1
  Top 0.152: R28.2 9.99,17.87
  Top 0.203: R30.2 R28.2 | 9.99,17.87 12.34,20.22 12.34,21.62 13.59,22.86 JP2.4 15.49,21.59 15.49,12.95 13.22,10.68 C46.2
GND  (via drill 0.35)
  Top 0.61: PAD1.1 11.68,72.75 C8.-
  Bottom 0.61: v36.83,55.12 v36.83,52.32
  pour Top: 0.71,79.55 0.71,0.61 79.25,0.61 79.25,79.55
MTEMP+
  Top 0.203: JP2.22 14.07,45.57 R15.1
MTEMP-
  Top 0.203: JP2.21 R16.1 R31.1
N$1
  Top 0.203: C1.1 11.16,9.76 10.76,10.16 R1.2 R11.1 14.22,16.93 JP2.2
N$2
  Top 0.203: R33.2 ALIVE.A
N$3
  Top 0.152: 21.78,60.17 D2.C 21.16,60.8
  Top 0.813: 21.78,60.17 L2.2 35.31,63.91 34.34,64.87 L5.1 | IC1.2 21.16,60.8
N$4
  Top 0.152: 11.68,64.09 C8.+ 12.51,64.87
  Top 0.61: C8.+ 11.68,66.8 PAD2.1
  Top 0.813: C10.1 17.64,63.05 IC1.1 12.51,64.87 | D1.C 11.68,64.09
N$5
  Top 0.203: R32.2 PWR.A
N$7
  Top 0.152: 63.67,35.19 Q1.1 63.27,34.8
  Top 0.203: C27.1 63.67,35.19 | IC4.6 57.63,36.86 59.69,34.8 63.27,34.8
  Top 0.305: Q1.1 63.55,35.05
  Top 0.406: JP17.1 63.55,35.05
N$8
  Top 0.152: C24.1 55.36,44.15 | 55.36,46.57 L3.1
  Top 0.203: IC4.13 54.84,40.36 56.13,41.66 56.13,43.23 55.36,44.15 | JP11.1 57.84,46.76 L3.1 | C24.1 55.36,46.57
N$9
  Top 0.203: IC6.9 10.44,32.03 9.14,30.73 JP8.1
N$10
  Top 0.203: JP7.9 55.37,70.61 58.67,70.61 60.36,68.92 R49.2
N$11  (via drill 0.35)
  Top 0.203: R39.1 v48.26,59.69
  Bottom 0.203: JP7.13 54.61,70.87 50.55,70.87 49.33,69.65 49.33,64.87 48.26,63.81 v48.26,59.69
N$12
  Top 0.152: R47.1 50.2,68.67
  Top 0.203: JP7.4 44.45,76.2 43.43,75.18 43.43,72.9 44.2,72.14 46.74,72.14 50.2,68.67
N$13
  Top 0.203: R48.1 54.27,70.87 50.29,70.87 48.51,72.64 48.51,75.18 47.5,76.2 JP7.6
N$14  (via drill 0.35)
  Top 0.152: 51.93,60.98 R37.2
  Top 0.203: IC7.6 66.29,70.87 66.55,71.12 v67.82,71.12 68.58,71.12 68.83,70.87 IC7.4 | v53.09,62.99 52.58,63.5 C32.2 51.93,60.98
  Bottom 0.203: v67.82,71.12 66.04,69.34 60.2,69.34 53.85,62.99 v53.09,62.99
N$15
  Top 0.152: 58.25,61.19 C33.1
  Top 0.203: R38.2 58.25,61.19 | C33.1 64.77,61.21 | 64.77,61.21 66.29,62.74 IC7.9 | 64.77,61.21 67.31,61.21 68.83,62.74 IC7.11
N$16
  Top 0.152: 24.74,4.96 L4.2 24.99,5.21
  Top 0.203: IC5.1 24.74,4.96 | JP13.1 25.73,7.5 D3.2 24.99,5.21
N$17
  Top 0.203: IC5.3 18.88,6.36 R36.2 R35.1
N$18
  Top 0.152: 24.7,10.9 D3.1 | 32.36,10.16 32.36,8.44 32.11,8.69 C45.+
  Top 0.203: R35.2 24.7,10.9 | D3.1 30.06,10.9 C45.+ | 32.36,10.16 34.5,12.31 C43.2 36.34,13.59 IC2A.2 | IC2B.6 33.81,6.99 32.36,8.44
  Top 0.508: C45.+ 31.35,8.85 PAD5.1
N$19
  Top 0.152: 61.72,13.04 R40.2
  Top 0.203: R41.1 60.71,15.75 61.72,14.73 61.72,13.04
N$20
  Top 0.152: 57.82,12.98 C34.1
  Top 0.203: 57.82,12.98 R41.2 R42.1
N$21
  Top 0.152: 53.99,15.72 R42.2
  Top 0.203: C35.1 53.99,15.72 | R42.2 R44.1
N$22
  Top 0.152: 50.2,12.98 C36.1
  Top 0.203: C36.1 C37.1 | R44.2 50.2,12.98
N$23  (via drill 0.35)
  Top 0.203: C39.2 44.96,16.62 44.96,15.24 44.58,14.86 IC2A.8 v40.64,14.86 | IC2B.2 v40.64,5.72
  Bottom 0.203: v40.64,14.86 v40.64,5.72
N$24  (via drill 0.35)
  Top 0.152: 46.12,12.95 C37.2 46.39,12.98
  Top 0.203: 46.12,12.95 45.48,13.59 IC2A.7 v41.66,13.59 | IC2B.3 v41.66,6.99 | R46.2 46.39,12.98
  Bottom 0.203: v41.66,13.59 v41.66,6.99
N$25
  Top 0.152: C44.2 C47.2 R52.1
N$26  (via drill 0.35)
  Top 0.152: 15.24,7.64 C46.1
  Top 0.203: 25.4,12.16 R52.2 29.94,12.16 32.64,14.86 IC2A.1 | 25.4,12.16 23.94,12.16 22.45,10.67 16.51,10.67 15.24,9.4 15.24,7.64 | v25.4,13.26 25.4,12.16 | IC2B.5 v36.07,8.26
  Bottom 0.203: v25.4,13.26 30.18,13.26 35.18,8.26 v36.07,8.26
N$27
  Top 0.152: 57.76,53.34 L1.2
  Top 0.203: JP1.1 62.21,55.88 60.96,54.63 C2.1 60.2,54.02 59.52,53.34 57.76,53.34
  Top 0.254: JP15.1 57.76,53.34
N$28
  Top 0.152: C26.1 64.52,20.32
  Top 0.203: 64.52,20.32 63.55,21.29 Q1.2 60.2,28.93 60.2,33.53 57.38,36.35 IC4.5
  Top 0.305: Q1.2 63.55,25.81
  Top 0.406: JP16.1 63.55,25.81
OUT_BRAKE
  Top 0.203: IC6.10 11.56,34.93 12.45,34.04 12.45,32.26 JP2.10
OUT_DCSW
  Top 0.203: IC6.11 11.56,36.2 14.22,33.53 JP2.12
  Top 0.254: IC6.12 IC6.11
OUT_ERR
  Top 0.152: IC6.13 11.05,38.73
  Top 0.203: 11.05,38.73 JP2.14
OUT_OVTMP
  Top 0.203: IC6.14 12.32,40.01 JP2.16
OUT_PRE
  Top 0.203: IC6.16 13.59,42.55 JP2.20
OUT_TEMP
  Top 0.203: IC6.15 13.59,41.28 JP2.18
PA1/TIM2_CH2  (via drill 0.35)
  Top 0.152: R43.1 75.53,65.28 | 72.76,63.83 IC7.14 | 72.9,68.76 IC7.1
  Top 0.203: R43.1 74.12,65.19 | 74.12,65.19 74.12,67.54 72.9,68.76 | IC9A.1 56.53,27.11 59.44,24.21 59.44,22.15 65.28,16.31 | v77.32,52.07 78.94,50.39 78.94,26.31 76.4,23.77 69.29,23.77 68.83,23.32 68.83,17.83 67.31,16.31 65.28,16.31 | v77.32,65.28 75.53,65.28 | 74.12,65.19 72.76,63.83 | IC7.13 71.37,62.75 68.06,59.44 60.91,59.44 57.83,56.36 54.68,56.36 53.24,54.92 53.24,44.81 55.14,42.9 55.14,41.94 54.56,41.35 IC4.15 | IC9B.1 67.56,8.03 68.43,8.89 76.25,8.89 77.22,9.86 77.22,14.02 76.15,15.09 66.5,15.09 65.28,16.31
  Top 0.254: IC7.13 IC7.14 | IC7.2 IC7.1
  Bottom 0.203: v77.32,65.28 v77.32,52.07
PA2/ADC2  (via drill 0.35)
  Top 0.152: IC4.16 53.59,41.89 | 30.71,30.06 C9.1 30.75,30.07
  Top 0.203: 53.59,41.89 v53.59,42.93 | v58.67,42.93 v58.67,38.91 | 30.71,30.06 R26.1 25.06,30.06 24.64,30.48 R4.2 | v32.26,30.07 30.75,30.07
  Bottom 0.203: v58.67,38.91 58.67,29.21 58.17,28.7 52.58,28.7 51.56,27.69 42.32,27.69 39.93,30.07 v32.26,30.07 | v58.67,42.93 v53.59,42.93
PA3/ADC3  (via drill 0.35)
  Top 0.152: 30.71,33.87 C7.1 | v32.26,33.88 32.25,33.9
  Top 0.203: 30.71,33.87 R23.1 27.34,33.02 R5.2 | IC4.17 52.05,43.43 v52.05,34.29 | v51.31,29.72 52.47,29.72 54.72,27.47 IC9A.3 53.7,26.09 v53.7,21.59 | 32.25,33.9 C7.1 | v68.83,7.87 IC9B.2
  Bottom 0.152: v32.26,33.88
  Bottom 0.203: v51.31,29.72 52.05,30.46 v52.05,34.29 52.05,34.44 49.91,36.58 46.99,36.58 45.72,35.31 45.72,34.34 45.26,33.88 v32.26,33.88 | v53.7,21.59 53.7,19.96 61.47,12.19 65.58,12.19 68.83,8.94 v68.83,7.87
PA4/ADC4  (via drill 0.35)
  Top 0.152: 30.71,37.68 C6.1 30.88,37.85
  Top 0.203: 30.71,37.68 R19.1 26.07,35.56 R6.2 | v32.26,37.85 30.88,37.85 | IC4.20 v50.27,38.25
  Bottom 0.203: v50.27,38.25 50.03,38.05 32.46,38.05 v32.26,37.85
PA5/ADC5  (via drill 0.35)
  Top 0.152: 58.25,66.06 C41.1 | R50.2 58.28,63.53 58.4,63.53 | IC7.8 64.95,63.75
  Top 0.203: R48.2 58.25,66.06 | C41.1 58.28,63.53 | IC4.21 49.76,44.84 50.02,45.1 v50.02,57.4 v50.01,57.4 | 64.95,63.75 64.26,63.75 62.48,61.98 v59.94,61.98 58.4,63.53 | IC7.5 67.56,67.56 65.02,65.02 IC7.8
  Bottom 0.203: v59.94,61.98 59.94,59.18 57.15,56.39 51.03,56.39 v50.01,57.4
PA6/TIM3_CH1  (via drill 0.35)
  Top 0.152: 49.25,50.71 C12.1
  Top 0.203: IC4.22 v49.25,45.62 49.25,50.71 | v32.66,47.5 33.68,46.48 33.68,35.92 35.43,34.16 35.43,26.29 34.54,25.4 v34.54,24.89 | R21.1 25.4,20.32 26.67,19.05 JP4.1
  Bottom 0.203: JP4.1 v34.54,24.89 | v32.66,47.5 33.38,47.5 33.78,47.09 47.78,47.09 v49.25,45.62
PA7/TIM3_CH2  (via drill 0.35)
  Top 0.203: v48.26,42.16 48.77,42.67 IC4.23 | v38.1,45.72 37.48,46.34 C11.1 | v24.38,15.24 R20.1
  Bottom 0.203: v24.38,15.24 12.95,15.24 7.11,9.4 4.32,9.4 1.78,11.94 1.78,41.4 4.85,44.48 29.74,44.48 31.75,46.48 38.1,46.48 | 38.1,46.48 41.4,46.48 44.2,43.69 47.04,43.69 48.26,42.47 v48.26,42.16 | v38.1,45.72 38.1,46.48
PA8/TIM1_CH1  (via drill 0.35)
  Top 0.203: v56.9,24.18 56.9,21.84 64.87,13.87 64.87,7.47 JP3.2 | IC4.41 46.13,37.85 46.76,37.21 v46.76,34.54 | v50.29,24.18 50.29,24.89 46.76,28.42 v46.76,29.21
  Bottom 0.203: v46.76,34.54 v46.76,29.21 | v56.9,24.18 56.74,24.33 50.44,24.33 v50.29,24.18
PA9/TIM1_CH2  (via drill 0.35)
  Top 0.203: v44.45,36.07 44.45,36.58 43.69,37.34 IC4.42 | v36.07,24.89 v36.07,36.07
  Bottom 0.203: JP3.6 54.1,1.78 38.61,1.78 37.59,2.79 37.59,21.84 36.07,23.37 v36.07,24.89 | v36.07,36.07 v44.45,36.07
PA10/TIM1_CH3  (via drill 0.35)
  Top 0.203: v45.72,22.35 45.72,22.86 44.96,23.62 44.96,25.61 43.66,26.9 43.66,36.55 43.35,36.86 IC4.43
  Bottom 0.203: v45.72,22.35 45.72,12.95 42.82,10.06 42.82,3.86 43.84,2.85 50.09,2.85 JP3.10
PA11/CANRX
  Top 0.203: IC3.4 3.68,48.39 2.54,49.53 2.54,53.59 4.32,55.37 16.51,55.37 19.3,52.58 32.77,52.58 35.41,49.94 35.41,41.3 40.33,36.35 IC4.44
PA12/CANTX
  Top 0.203: IC4.45 40.01,35.84 34.9,40.95 34.9,49.68 32.51,52.07 19.05,52.07 16.26,54.86 7.05,54.86 IC3.1
PB0/ADC8  (via drill 0.35)
  Top 0.152: 62.06,66.06 C42.1 | 62.09,63.53 R51.1 | IC7.7 64.85,68.58
  Top 0.203: 62.06,66.06 R49.1 64.85,68.58 | C42.1 62.09,63.53 | v46.74,48.77 47.24,48.26 IC4.26 | v67.56,65.79 IC7.10 | IC7.7 v65.02,67.06
  Bottom 0.203: v65.02,67.06 66.29,65.79 v67.56,65.79 70.1,63.25 70.1,54.86 67.31,52.07 51.05,52.07 47.75,48.77 v46.74,48.77
PB1/ADC9  (via drill 0.35)
  Top 0.152: 4.42,42.42 IC6.1
  Top 0.203: v5.84,42.42 4.42,42.42 | v47.24,42.16 46.76,42.65 IC4.27
  Bottom 0.203: v5.84,42.42 6.1,42.42 6.6,41.91 31.24,41.91 32.16,42.82 45.06,42.82 45.72,42.16 v47.24,42.16
PB5  (via drill 0.35)
  Top 0.152: 30.71,22.44 C16.1
  Top 0.203: 30.71,22.44 R29.1 27.6,22.44 24.64,25.4 R2.2 | v45.52,29.21 46.43,30.12 47.4,30.12 48.26,30.99 IC4.57 | v33.27,31.75 33.27,27.18 32,25.91 32,23.11 31.36,22.47 C16.1
  Bottom 0.203: v33.27,31.75 33.63,31.39 40.49,31.39 42.67,29.21 v45.52,29.21
PB6/TIM4_CH1  (via drill 0.35)
  Top 0.152: 30.71,26.25 C15.1 | v32.26,27.79 v32.25,27.79
  Top 0.203: 30.71,26.25 R27.1 25.82,26.25 24.13,27.94 R3.2 | v52.58,25.91 52.58,26.42 48.77,30.23 IC4.58 | v32.25,27.79 C15.1
  Bottom 0.203: v32.26,27.79 40.03,27.79 42.16,25.65 46.48,25.65 46.74,25.91 v52.58,25.91
PB7/TIM4_CH2  (via drill 0.35)
  Top 0.203: v61.72,58.42 68.73,58.42 77.78,49.38 77.78,26.42 76.05,24.69 69.09,24.69 68.07,23.67 68.07,18.29 67.21,17.42 65.63,17.42 60.35,22.71 60.35,26.77 59.18,27.94 59.18,29.72 58.67,30.23 53.14,30.23 52.63,30.73 49.43,30.73 49.25,30.91 IC4.59 | R37.1 50.2,60.45 50.71,59.94 52.68,59.94 v53.09,59.54
  Bottom 0.203: v61.72,58.42 61.72,62.23 60.2,63.75 57.3,63.75 v53.09,59.54
PB8/TIM4_CH3  (via drill 0.35)
  Top 0.152: 56.64,59.09 R38.1
  Top 0.203: IC4.61 50.27,36.25 49.28,37.24 v49.28,42.16 | v56.64,57.66 56.64,59.09 | v43.18,48.67 44.45,47.4 v44.45,45.72
  Bottom 0.203: v43.18,48.67 41.91,49.94 41.91,54.86 45.47,58.42 55.88,58.42 v56.64,57.66 | v44.45,45.72 46.23,45.72 49.28,42.67 v49.28,42.16
PB9/TIM4_CH4  (via drill 0.35)
  Top 0.152: 4.42,41.15 IC6.2
  Top 0.203: IC4.62 50.75,36.17 51.26,36.68 v51.26,39.27 | v5.84,41.15 4.42,41.15
  Bottom 0.203: v51.26,39.27 43.33,39.27 43.25,39.35 8.1,39.35 6.3,41.15 v5.84,41.15
PB10/USART3_TX  (via drill 0.35)
  Top 0.203: v46.48,50.04 45.74,49.3 IC4.29
  Bottom 0.203: JP1.3 49.78,53.34 v46.48,50.04
PB11/USART3_RX  (via drill 0.35)
  Top 0.203: v44.96,50.8 45.26,50.5 IC4.30
  Bottom 0.203: v44.96,50.8 48.77,54.61 64.01,54.61 JP1.4
PB12/TIM1_BKIN  (via drill 0.35)
  Top 0.152: 54.83,20.83 54.8,20.86 | 70.16,11.91 IC9B.12
  Top 0.203: v38.1,43.94 40.18,41.86 IC4.33 | IC9A.4 54.72,20.94 54.8,20.86 53.75,19.81 48.01,19.81 47.24,20.57 37.59,20.57 33.53,24.64 33.53,25.65 34.8,26.92 34.8,33.78 33.02,35.56 33.02,43.59 v32.66,43.94 | v54.97,20.83 54.83,20.83 | v70.16,13.82 70.16,11.91
  Bottom 0.203: v32.66,43.94 v38.1,43.94 | v54.97,20.83 60.71,20.83 66.47,15.06 69.37,15.06 70.16,14.28 v70.16,13.82
PC0/ADC10  (via drill 0.35)
  Top 0.203: R25.2 C14.1 6.21,26.78 v6.6,27.18 | v60.2,37.85 IC4.8
  Bottom 0.203: v6.6,27.18 7.31,27.89 12.4,27.89 13.72,29.21 39.62,29.21 41.66,27.18 51.82,27.18 52.83,28.19 59.18,28.19 60.2,29.21 v60.2,37.85
PC1/ADC11  (via drill 0.35)
  Top 0.152: C13.1 6.35,20.32
  Top 0.203: R24.2 6.35,20.32 6.35,22.1 v5.84,22.61 | IC4.9 56.87,38.35 v57.15,38.63 | v59.08,26.06 57.15,27.99 v57.15,29.46
  Bottom 0.203: v5.84,22.61 9.91,26.67 38.35,26.67 40.13,24.89 48.77,24.89 49.15,25.27 51.69,25.27 51.94,25.02 58.04,25.02 v59.08,26.06 | v57.15,29.46 v57.15,38.63
PC2/ADC12  (via drill 0.35)
  Top 0.152: 22.72,48.29 R31.2
  Top 0.203: IC4.10 55.37,38.86 57.15,40.64 57.15,42.62 v59.18,44.65 | v24.08,48.26 R31.2 | C17.1 22.72,48.29
  Bottom 0.203: v24.08,48.26 24.59,47.75 31.24,47.75 31.75,48.26 33.58,48.26 34.14,47.7 51.61,47.7 54.66,44.65 v59.18,44.65
PC3/ADC13
  Top 0.152: 51.9,66.06 C40.1
  Top 0.203: R47.2 51.9,66.06 | C40.1 53.59,66.04 54.51,65.13 54.51,57.81 52.53,55.83 52.53,39.62 52.8,39.35 IC4.11
PC4/ADC14
  Top 0.152: 48.23,55.51 R39.2
  Top 0.203: C31.1 48.23,55.51 | IC4.24 R39.2
PC5/ADC15
  Top 0.203: IC6.7 2.41,34.93 1.78,35.56 1.78,53.85 4.57,56.64 16.76,56.64 19.71,53.69 44.61,53.69 47.75,50.55 IC4.25
PC6  (via drill 0.35)
  Top 0.152: 30.71,41.49 C5.1 30.88,41.66
  Top 0.203: 30.71,41.49 R13.1 24.8,38.1 R7.2 | v38.25,41.66 38.25,41.35 39.75,39.85 IC4.37 | v32.26,41.66 30.88,41.66
  Bottom 0.203: v32.26,41.66 v38.25,41.66
PC7  (via drill 0.35)
  Top 0.152: 30.71,45.3 C4.1 | v32.41,45.31 32.4,45.3
  Top 0.203: R8.2 23.53,40.64 R12.1 30.71,45.3 32.4,45.3 | v36.83,45.31 36.68,45.16 36.68,41.91 39.24,39.35 IC4.38
  Bottom 0.203: v36.83,45.31 v32.41,45.31
PC8  (via drill 0.35)
  Top 0.152: 30.71,49.11 C3.1 30.75,49.15 | R10.1 27.69,49.11
  Top 0.203: R10.1 30.71,49.11 | 27.69,49.11 25.91,47.33 25.91,45.3 23.79,43.18 R9.2 | v36.58,49.15 36.07,48.64 36.07,41.66 38.86,38.86 IC4.39 | v32.36,49.15 30.75,49.15
  Bottom 0.203: v36.58,49.15 v32.36,49.15
PC9  (via drill 0.35)
  Top 0.152: 68.78,11.91 IC9B.13 | 54.01,18.4 R45.1
  Top 0.203: 56.06,20.45 56.42,20.09 57.38,20.09 v57.4,20.07 | 56.06,20.45 56.02,20.48 IC9A.6 | R45.1 v52.32,18.29 | C38.1 v52.32,21.59 52.32,24.64 48.03,28.93 v48.03,29.21 | v48.03,35.56 48.03,37.57 47.24,38.35 IC4.40 | v68.78,13.77 68.78,11.91 | 56.06,20.45 54.01,18.4
  Bottom 0.203: JP3.13 45.72,9.14 45.72,10.67 52.32,17.27 v52.32,18.29 v52.32,21.59 | v57.4,20.07 59.79,20.07 66.09,13.77 v68.78,13.77 | v48.03,35.56 v48.03,29.21
PC10  (via drill 0.35)
  Top 0.152: 5.08,38.61 4.83,38.86 4.7,38.73 IC6.4
  Top 0.203: v5.84,38.61 5.08,38.61 | v44.45,34.7 45.26,33.88 IC4.51
  Bottom 0.203: v5.84,38.61 6.3,38.61 10.62,34.29 31.24,34.29 31.9,34.95 34.65,34.95 34.9,34.7 v44.45,34.7
PC11  (via drill 0.35)
  Top 0.152: 4.42,39.88 IC6.3 | v45.72,36.88 45.74,36.88
  Top 0.203: v5.84,39.88 4.42,39.88 | 45.74,36.88 IC4.52
  Bottom 0.203: v5.84,39.88 6.3,39.88 9.35,36.83 33.53,36.83 34.04,37.34 45.26,37.34 v45.72,36.88
PC12  (via drill 0.35)
  Top 0.152: ALIVE.C 75.02,16.31
  Top 0.203: v46.99,22.35 46.99,26.21 44.78,28.42 44.78,30.91 45.11,31.24 46.07,31.24 46.25,31.42 IC4.53 | 75.02,16.31 v72.64,16.31
  Bottom 0.203: v46.99,22.35 47.14,22.5 54.25,22.5 55.17,21.59 61.77,21.59 67.06,16.31 v72.64,16.31
PC13  (via drill 0.35)
  Top 0.152: IC6.5 4.29,37.34
  Top 0.203: v5.84,37.34 4.29,37.34 | IC4.2 v55.88,34.85
  Top 0.254: 4.29,37.34 IC6.6
  Bottom 0.203: v5.84,37.34 5.99,37.34 11.58,31.75 31.85,31.75 32.87,30.73 40.28,30.73 42.88,28.14 51.26,28.14 55.88,32.77 v55.88,34.85
PD2/TIM3_ETR  (via drill 0.35)
  Top 0.152: 63.5,12.79 R40.1 | R30.1 C18.1 6.21,13.58 v5.33,12.7
  Top 0.203: v63.5,10.67 63.5,12.79 | JP5.1 37.59,16.51 | 37.59,16.51 38.35,16.51 39.75,15.11 39.75,10.03 40.13,9.65 v48.01,9.65 | 37.59,16.51 37.59,19.56 32.77,24.38 32.77,25.78 34.04,27.05 v34.04,33.02 | v45.52,30.48 46.08,30.48 46.76,31.17 IC4.54
  Bottom 0.203: v63.5,10.67 49.02,10.67 v48.01,9.65 | v5.33,12.7 9.14,16.51 JP5.1 | v45.52,30.48 42.27,30.48 40.69,32.05 35,32.05 v34.04,33.02
RST
  Top 0.152: 62.23,39.37 62.23,39.62 | 62.23,39.62 R34.1 | 62.37,39.77 62.23,39.62
  Top 0.203: 62.23,39.37 61.72,38.86 61.72,37.34 61.21,36.83 59.44,36.83 58.93,37.34 IC4.7 | 62.37,39.77 C21.2 71.49,39.77 72.64,38.61 JP6.10
SIG_BMS
  Top 0.203: JP2.19 R9.1
SIG_BRAKE
  Top 0.203: JP2.9 R4.1
SIG_CRUISE
  Top 0.203: JP2.5 R2.1
SIG_EMCYSTOP
  Top 0.203: JP2.17 R8.1
SIG_FORWARD
  Top 0.203: JP2.13 R6.1
SIG_MPROT
  Top 0.203: JP2.11 R5.1
SIG_REVERSE
  Top 0.203: JP2.15 R7.1
SIG_START
  Top 0.203: JP2.7 R3.1
SWDCLK  (via drill 0.35)
  Top 0.203: IC4.49 44.25,27.74 v45.57,26.42 | v70.36,28.96 JP6.4
  Bottom 0.203: v70.36,28.96 69.6,29.72 62.79,29.72 60.3,27.23 52.73,27.23 52.05,26.54 45.7,26.54 v45.57,26.42
SWDIO  (via drill 0.35)
  Top 0.203: v37.59,23.88 37.59,25.15 38.35,25.91 38.35,33.53 40.18,35.36 IC4.46 | v70.36,26.42 JP6.2
  Bottom 0.203: v70.36,26.42 66.14,22.2 55.32,22.2 54.41,23.11 38.35,23.11 v37.59,23.88
THROTTLE1
  Top 0.152: R22.2 10.03,22.86 | R24.1 10.03,20.36
  Top 0.203: JP2.6 14.22,25.15 11.94,22.86 10.03,22.86 10.03,20.36
THROTTLE2
  Top 0.152: R25.1 R14.2
  Top 0.203: R14.2 JP2.8
TIM1_CH1N  (via drill 0.35)
  Top 0.203: JP3.3 61.21,6.35 61.21,4.19 62.23,3.18 63.88,3.18 65.02,4.32 v65.02,5.33 | v44.2,41.5 44.04,41.35 IC4.34
  Bottom 0.203: v65.02,5.33 66.55,5.33 67,5.79 77.67,5.79 78.89,7.01 78.89,40.28 77.83,41.35 44.35,41.35 v44.2,41.5
TIM1_CH2N  (via drill 0.35)
  Top 0.203: v40.64,40.79 40.69,40.84 IC4.35
  Bottom 0.203: JP3.7 56.13,6.35 63.75,6.35 64.06,6.66 76.91,6.66 78.13,7.87 78.13,39.9 77.27,40.77 40.66,40.77 v40.64,40.79
TIM1_CH3N  (via drill 0.35)
  Top 0.203: v44.2,40.01 43.84,40.36 IC4.36 | v66.04,9.91 v75.13,9.91
  Bottom 0.203: v44.2,40.01 44.32,40.13 76.76,40.13 77.22,39.68 77.22,10.31 76.81,9.91 v75.13,9.91 | JP3.11 51.31,9.14 64.26,9.14 65.02,9.91 v66.04,9.91
VCC  (via drill 0.35)
  Top 0.152: 18.21,2.36 C28.1 16.27,2.53 v16.26,2.54 | 4.51,49.53 IC3.3 | 75.53,66.8 R43.2 | 39.12,23.95 IC8.3 | 40.31,64.87 40.37,64.81 | 24.74,2.36 L4.1 24.92,2.34
  Top 0.203: 18.21,2.36 IC5.4 IC5.5 24.74,2.36 | v57.4,18.29 R45.2 | v24.08,22.86 R18.1 | v24.38,17.78 R17.1 | R15.2 v5.84,45.57 | v6.35,49.53 4.51,49.53 | v6.6,17.78 R28.1 | v6.6,12.7 R11.2 | v77.32,66.8 75.53,66.8 | IC7.3 v70.1,66.8 | v39.12,21.84 39.12,23.95 | JP12.1 24.92,2.34
  Top 0.254: IC1.4 24.56,63.17 v24.38,62.99
  Top 0.61: C19.1 v45.47,61.98 C20.+
  Top 0.813: L2.1 40.37,64.81 43.2,61.98 v45.47,61.98 | L5.2 40.31,64.87
  Bottom 0.203: v70.1,66.8 v77.32,66.8
  pour Bottom: 79.25,0.61 0.71,0.61 0.71,79.55 79.25,79.55 79.25,59.18 39.12,59.18 39.12,23.37 53.34,23.37 55.12,21.59 79.25,21.59
VCCIO  (via drill 0.35)
  Top 0.152: R33.1 75.18,22.61 | L1.1 55.17,53.06 | IC8.2 41.89,24.5 | C29.2 41.89,31.63 | 53.59,31.97 C30.2 | 55.17,50.24 L3.2 | 50.75,45.42 v50.8,45.47 | 70.27,22.61 R32.1 | 67.56,12.45 IC9B.14 | 53.59,34.32 IC4.1
  Top 0.203: 55.17,53.06 L3.2 | 41.89,31.63 C22.1 | C30.2 52.85,32.49 IC4.64 | IC4.32 43.3,43.71 C23.2 41.26,44.84 40.64,45.47 40.64,48.01 v41.3,48.67 | IC4.48 42.39,33.63 v41.78,33.02 41.77,33.01 C29.2 | C25.2 51.05,45.72 v50.8,45.47 | IC4.19 50.75,45.42 | 70.27,22.61 v72.64,22.61 75.18,22.61 | IC3.5 7.75,48.39 v7.11,47.75 | v61.98,42.93 62.23,42.67 R34.2 | 67.56,12.45 58.17,21.84 v58.17,23.37 | IC9A.5 v55.37,23.52 | 53.59,31.97 v53.59,33.27 53.59,34.32
  Top 0.254: v54.25,51.16 55.17,50.24
  Top 0.305: 41.89,24.5 C22.1
  Top 0.61: v75.18,38.86 75.18,42.22 v76.05,43.08
  Bottom 0.152: v58.17,23.37 58.01,23.22 55.68,23.22 v55.37,23.52
  Bottom 0.203: v7.11,47.75 7.87,46.99 21.08,46.99 24.64,50.55 39.42,50.55 v41.3,48.67
  pour Bottom: 53.85,23.88 39.88,23.88 39.88,58.42 79.25,58.42 79.25,22.1 55.63,22.1

### Text on the board
tNames: + | + | (C) 2018 Johannes Huebner | * Unofficial Clone * | openinverter.org main board | TDA2822D | IC9A OR IC9B | + | LM386M | IC2A OR IC2B